# EAGLE design relay_distribution_brd (EAGLE 9.2.1)
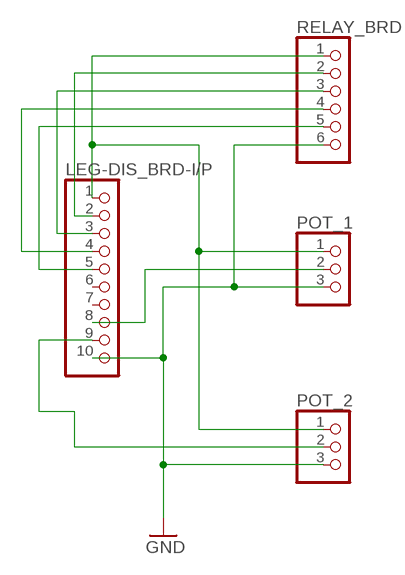
[diagram p0: schematic, sheet 1]

## Parts
LEG-DIS_BRD-I/P  PINHD-1X10  [1X10]
POT_1  PINHD-1X3  [1X03]
POT_2  PINHD-1X3  [1X03]
RELAY_BRD  PINHD-1X6  [1X06]

## Nets
GND: LEG-DIS_BRD-I/P.10 POT_1.3 POT_2.3 RELAY_BRD.6
N$1: LEG-DIS_BRD-I/P.1 POT_1.1 POT_2.1 RELAY_BRD.1
N$2: LEG-DIS_BRD-I/P.9 POT_2.2
N$3: LEG-DIS_BRD-I/P.8 POT_1.2
N$4: LEG-DIS_BRD-I/P.2 RELAY_BRD.2
N$5: LEG-DIS_BRD-I/P.3 RELAY_BRD.3
N$6: LEG-DIS_BRD-I/P.5 RELAY_BRD.5
N$7: LEG-DIS_BRD-I/P.4 RELAY_BRD.4
Unconnected: LEG-DIS_BRD-I/P.6 LEG-DIS_BRD-I/P.7

## Library data of the parts
LEG-DIS_BRD-I/P = pinhead:PINHD-1X10: PIN HEADER
POT_1 POT_2 = pinhead:PINHD-1X3: PIN HEADER
RELAY_BRD = pinhead:PINHD-1X6: PIN HEADER

## Board
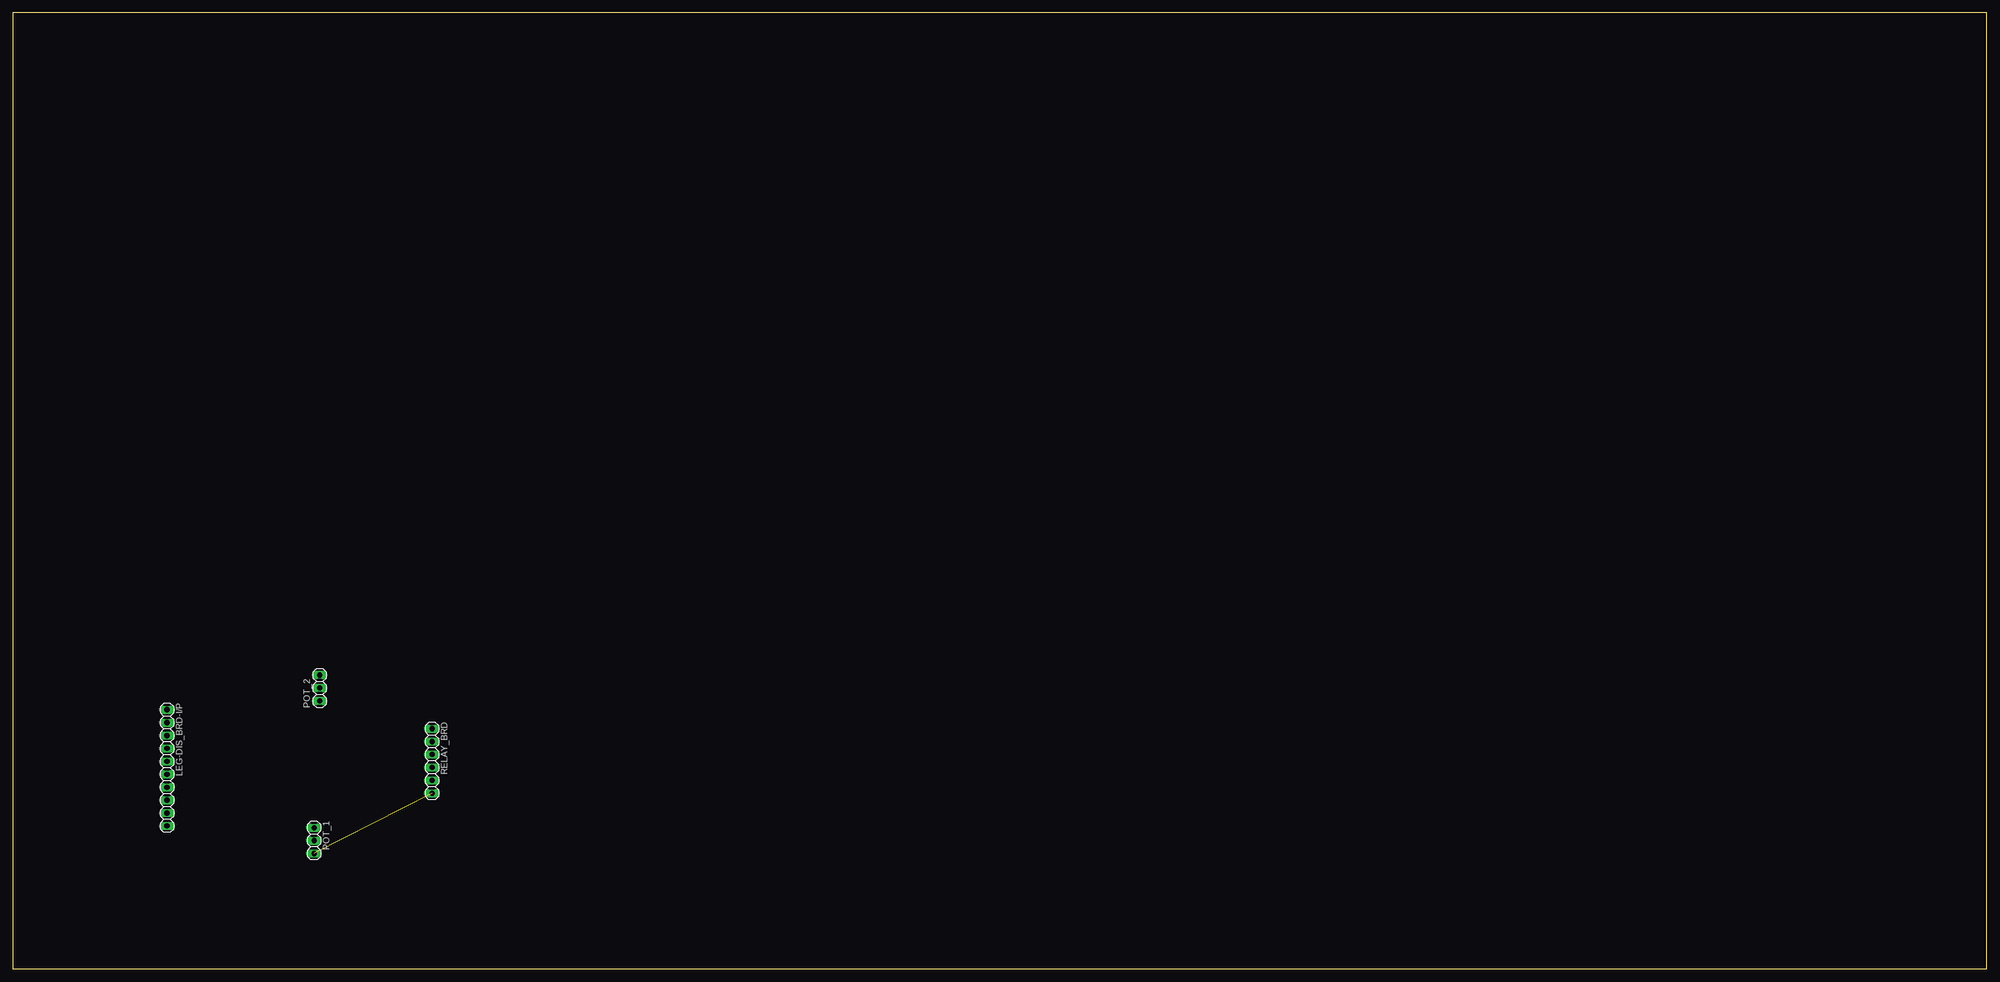
[diagram p1: board, top side]
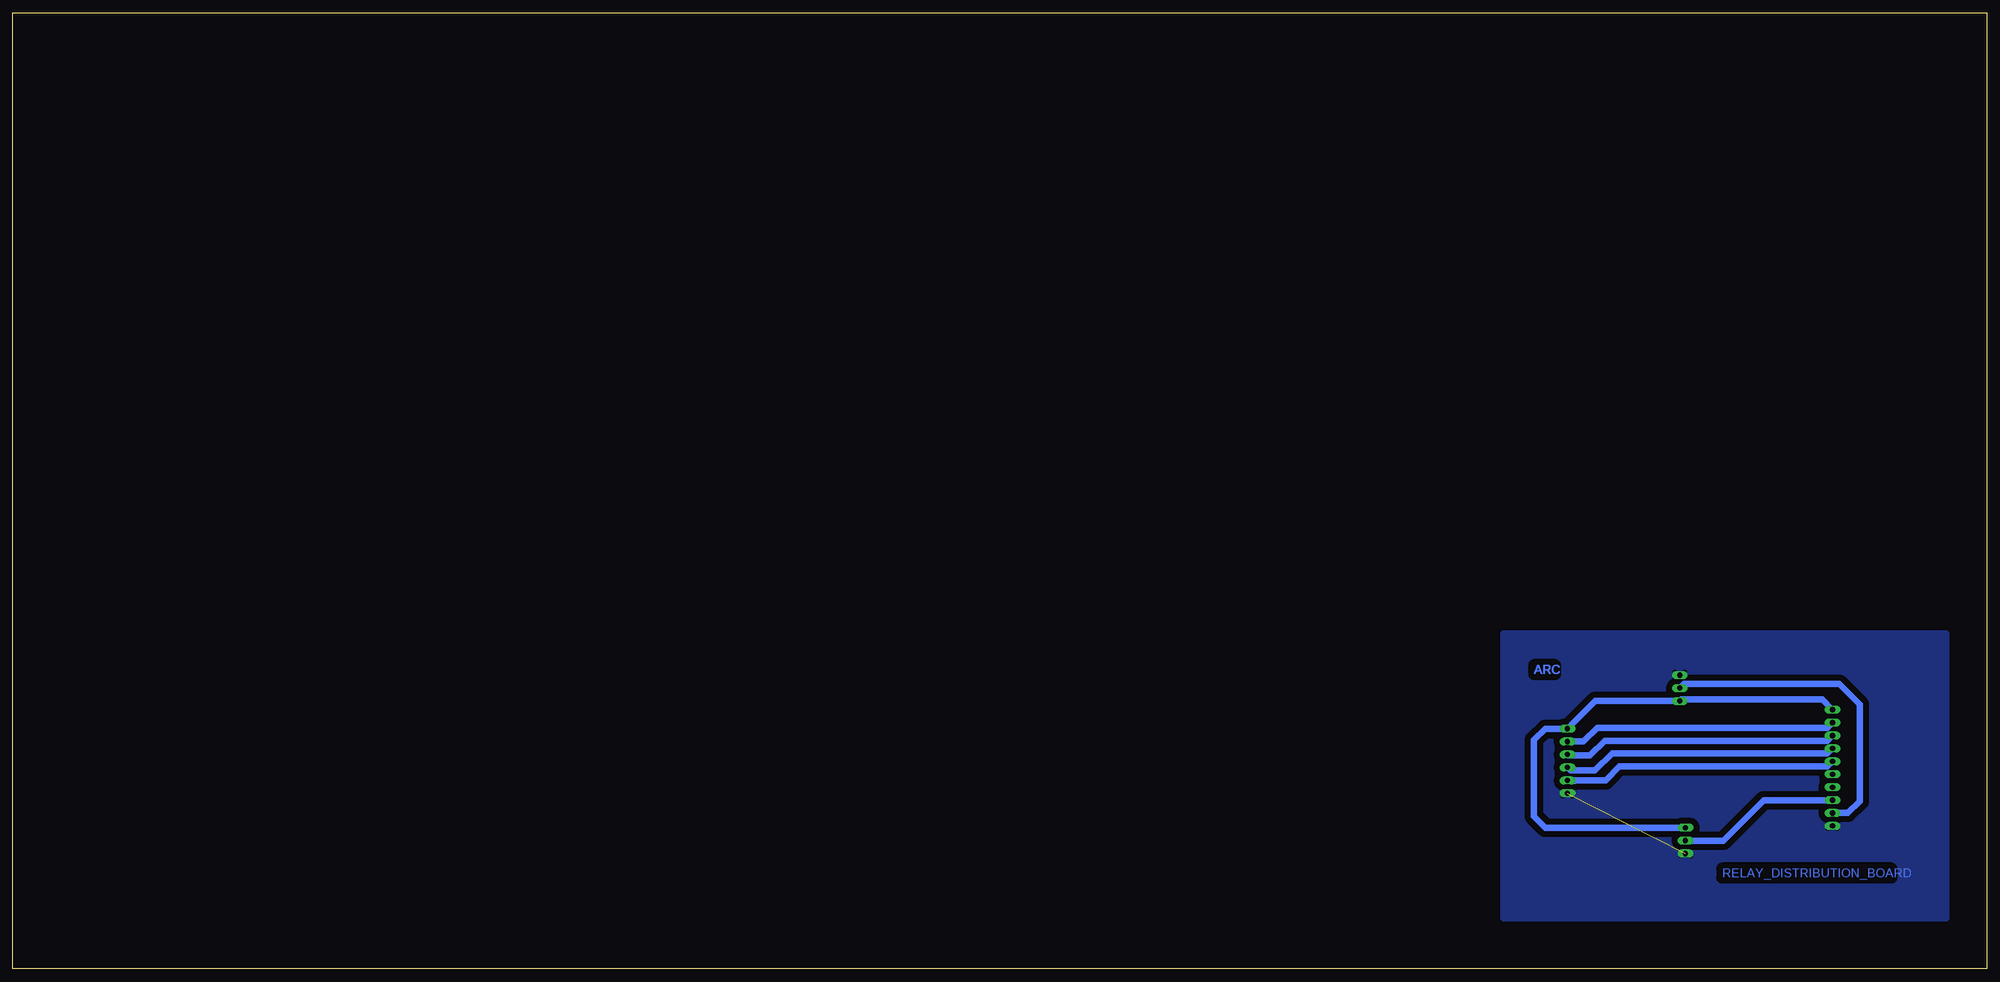
[diagram p2: board, bottom side, seen from below]

Size 388 x 188 mm. Coordinates in mm from the lower left corner, seen from the top.
Outline: 0,0 388,0 388,188 0,188 0,0
Copper layers (1*16): Top 0.035mm / dielectric 1.5mm / Bottom 0.035mm
Design rules "default": minimum track width 6mil, minimum drill 0.35mm, track to track 6mil, track to pad 6mil, pad to pad 6mil, via to via 6mil, smd to smd 6mil, copper to edge 40mil, drill to drill 6mil, minimum pad ring 10mil, minimum via ring 8mil, stop-mask expansion 4mil, vias tented up to drill 0mil, thermal gap 10mil

### Footprints (pad centres in the part's own frame; a part is rotated, then mirrored left to right if it is on the bottom)
1X10 = drill 1.016 long: 1 -11.43,0; 2 -8.89,0; 3 -6.35,0; 4 -3.81,0; 5 -1.27,0; 6 1.27,0; 7 3.81,0; 8 6.35,0; 9 8.89,0; 10 11.43,0
1X03 = drill 1.016 long: 1 -2.54,0; 2 0,0; 3 2.54,0
1X06 = drill 1.016 long: 1 -6.35,0; 2 -3.81,0; 3 -1.27,0; 4 1.27,0; 5 3.81,0; 6 6.35,0

### Placement (x,y rotation side)
LEG-DIS_BRD-I/P  30.33,39.54 270 top
POT_1  59.22,25.24 270 top
POT_2  60.33,55.24 90 top
RELAY_BRD  82.41,40.89 270 top

### Tracks (layer width: path | path; a pad name or v marks a point on that pad's centre or on a via)
GND  (1 unrouted)
  pour Bottom (isolate 1.2): 93,66 8,66 8,10 95,10 95,66 94,66
N$1
  Bottom 1.27: LEG-DIS_BRD-I/P.1 32.36,53 60.03,53 POT_2.1 76.95,52.7 RELAY_BRD.1 86.76,47.24 89,45 89,30 86.78,27.78 POT_1.1
N$2
  Bottom 1.27: LEG-DIS_BRD-I/P.9 27.35,30.65 25,33 25,52 29,56 59.57,56 POT_2.2
N$3
  Bottom 1.27: LEG-DIS_BRD-I/P.8 43.81,33.19 51.76,25.24 POT_1.2
N$4
  Bottom 1.27: LEG-DIS_BRD-I/P.2 31.33,47.43 76.57,47.43 79.3,44.7 RELAY_BRD.2
N$5
  Bottom 1.27: LEG-DIS_BRD-I/P.3 31.33,44.89 75.11,44.89 78,42 82.25,42 RELAY_BRD.3
N$6
  Bottom 1.27: LEG-DIS_BRD-I/P.5 31.32,39.82 72.18,39.82 74.91,37.09 81.09,37.09 81,37 82.33,37 RELAY_BRD.5
N$7
  Bottom 1.27: LEG-DIS_BRD-I/P.4 31.32,42.36 73.64,42.36 77,39 81.79,39 RELAY_BRD.4

### Text on the board
Bottom: ARC | ARC | ARC | ARC | ARC | ARC | ARC | ARC | RELAY_DISTRIBUTION_BOARD